# EAGLE design shiftreg-io (EAGLE 9.0.1)
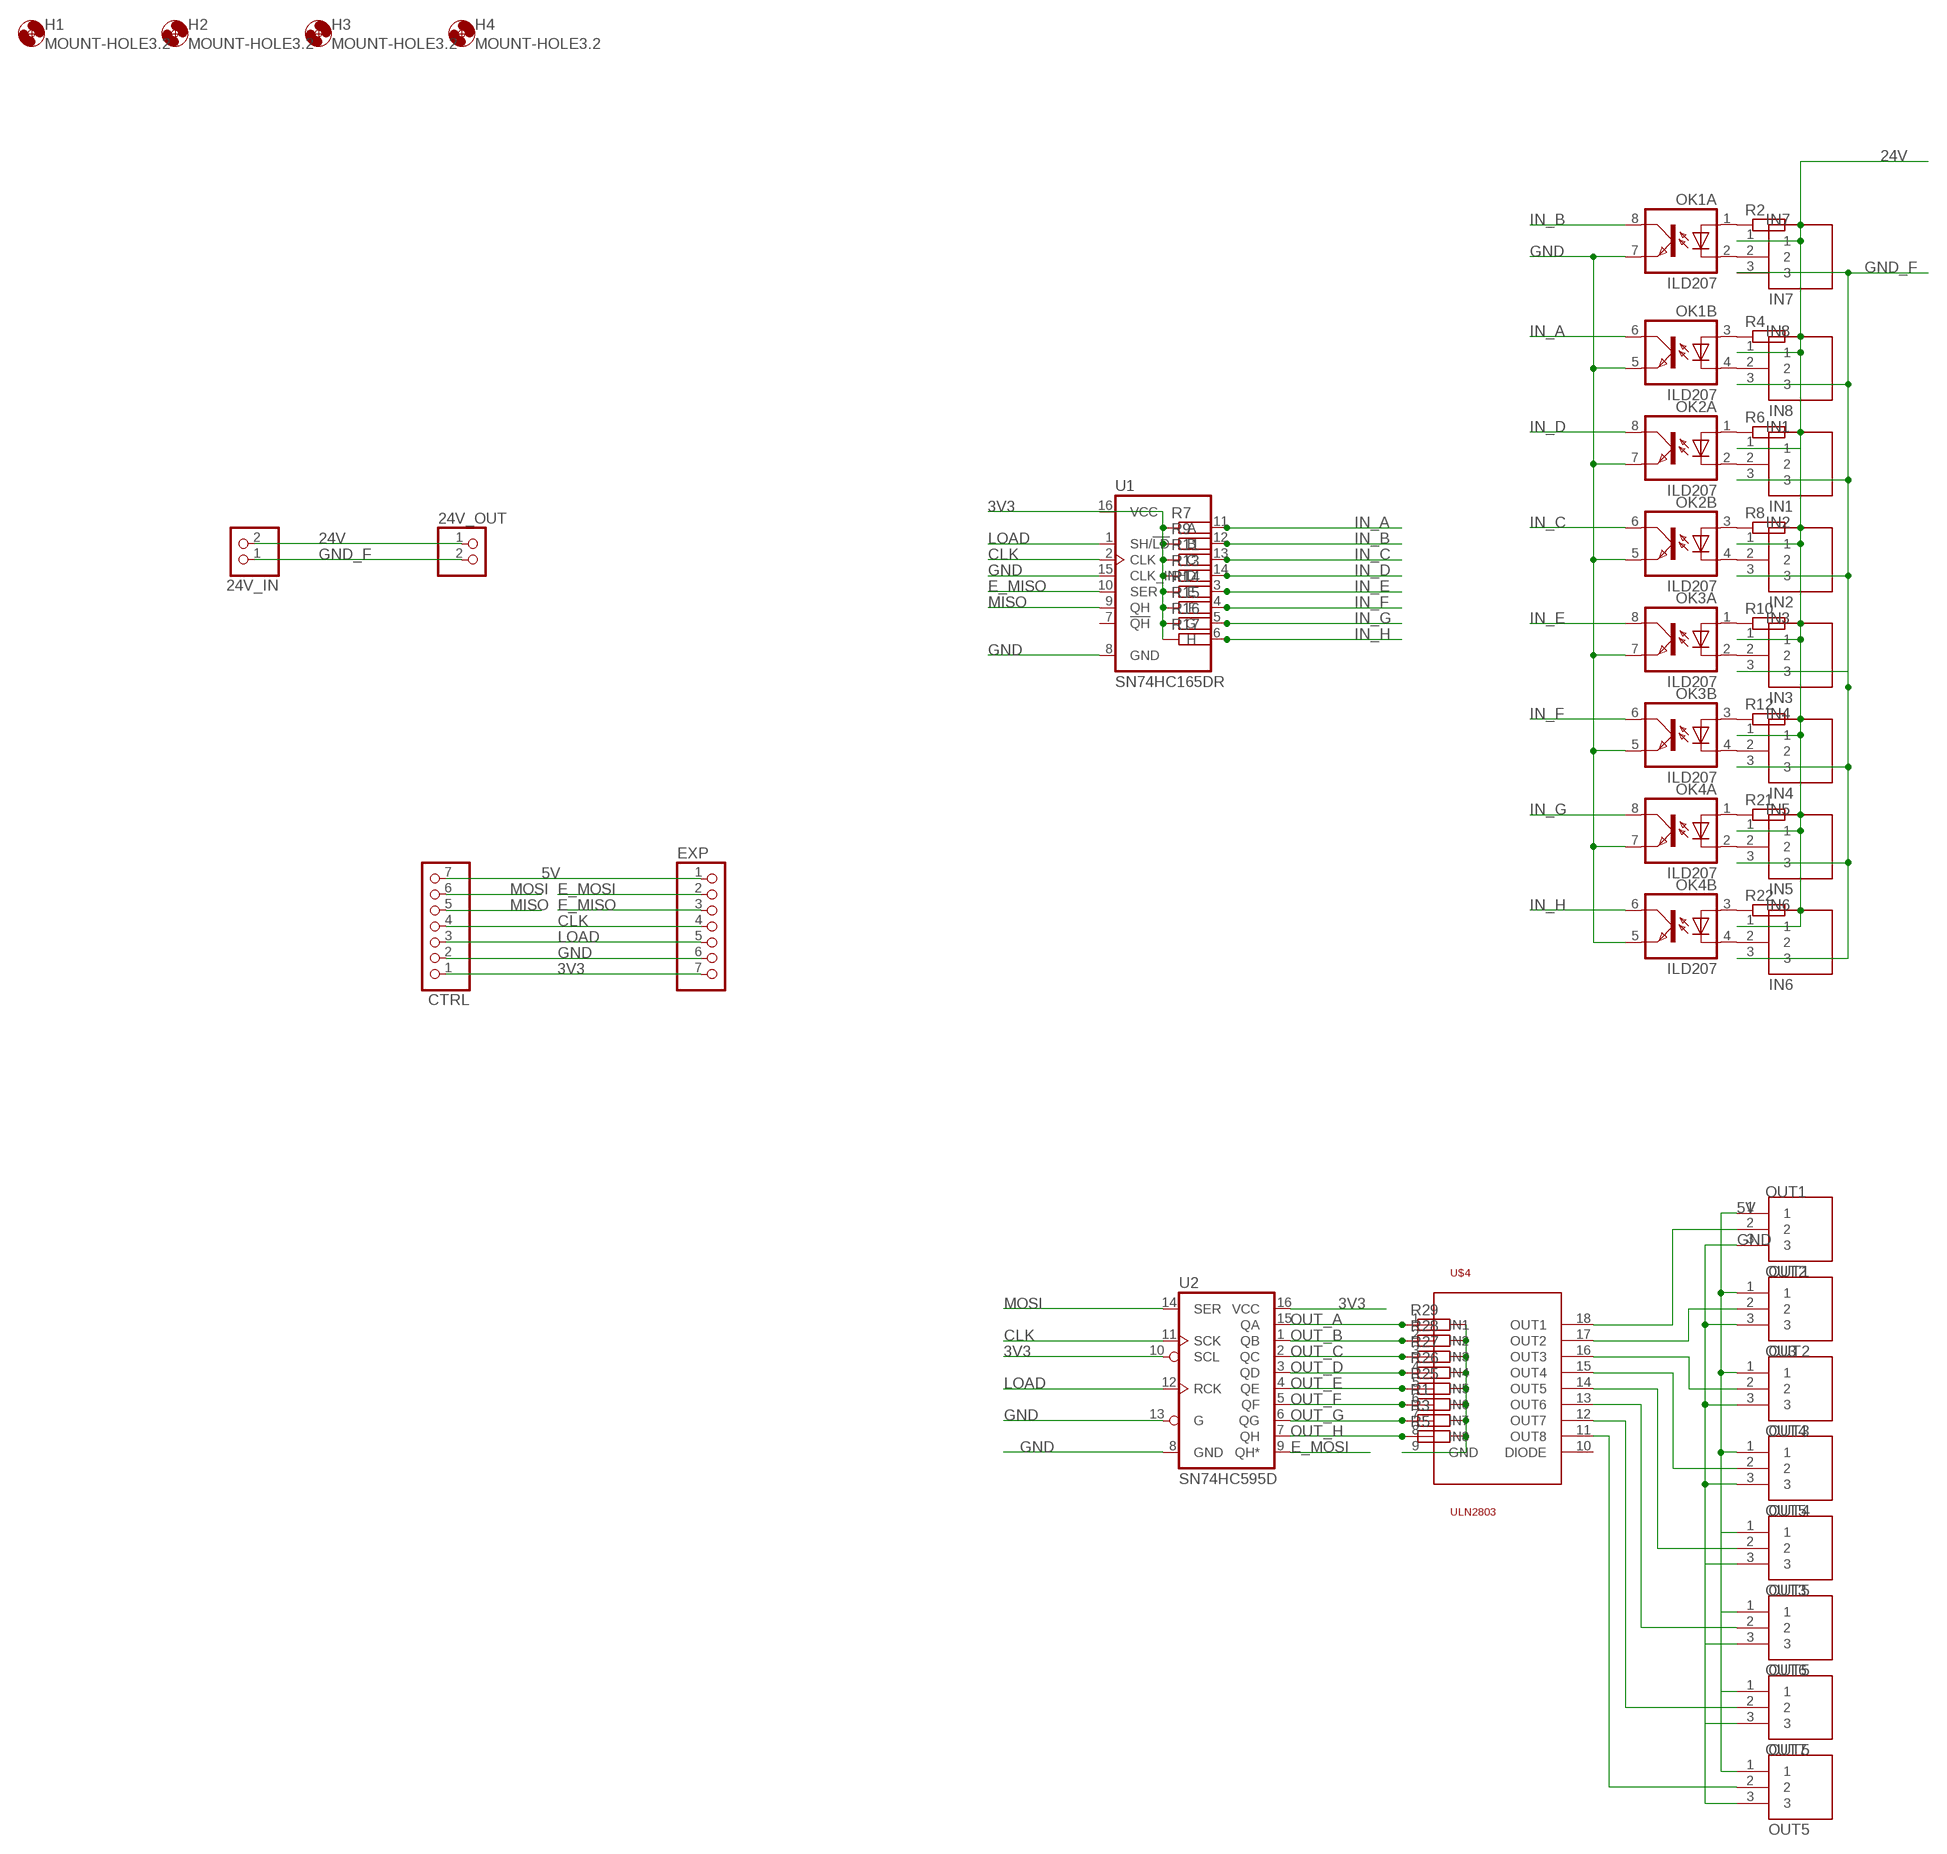
[diagram p0: schematic, sheet 1]

## Parts
24V_IN  PINHD-1X2  [1X02]
24V_OUT  PINHD-1X2  [1X02]
CTRL  PINHD-1X7  [1X07]
EXP  PINHD-1X7  [1X07]
H1  MOUNT-HOLE3.2  [3,2]
H2  MOUNT-HOLE3.2  [3,2]
H3  MOUNT-HOLE3.2  [3,2]
H4  MOUNT-HOLE3.2  [3,2]
IN1  IN1  284512-3  [TE_284512-3]
IN2  IN2  284512-3  [TE_284512-3]
IN3  IN3  284512-3  [TE_284512-3]
IN4  IN4  284512-3  [TE_284512-3]
IN5  IN5  284512-3  [TE_284512-3]
IN6  IN6  284512-3  [TE_284512-3]
IN7  IN7  284512-3  [TE_284512-3]
IN8  IN8  284512-3  [TE_284512-3]
OK1  ILD207  [SOIC08]
OK2  ILD207  [SOIC08]
OK3  ILD207  [SOIC08]
OK4  ILD207  [SOIC08]
OU3  OUT3  284512-3  [TE_284512-3]
OUT1  OUT1  284512-3  [TE_284512-3]
OUT2  OUT2  284512-3  [TE_284512-3]
OUT3  OUT5  284512-3  [TE_284512-3]
OUT4  OUT4  284512-3  [TE_284512-3]
OUT5  OUT5  284512-3  [TE_284512-3]
OUT6  OUT5  284512-3  [TE_284512-3]
OUT7  OUT5  284512-3  [TE_284512-3]
R1  R-EU_M0805  [M0805]
R2  R-EU_M0805  [M0805]
R3  R-EU_M0805  [M0805]
R4  R-EU_M0805  [M0805]
R5  R-EU_M0805  [M0805]
R6  R-EU_M0805  [M0805]
R7  R-EU_M0805  [M0805]
R8  R-EU_M0805  [M0805]
R9  R-EU_M0805  [M0805]
R10  R-EU_M0805  [M0805]
R11  R-EU_M0805  [M0805]
R12  R-EU_M0805  [M0805]
R13  R-EU_M0805  [M0805]
R14  R-EU_M0805  [M0805]
R15  R-EU_M0805  [M0805]
R16  R-EU_M0805  [M0805]
R17  R-EU_M0805  [M0805]
R21  R-EU_M0805  [M0805]
R22  R-EU_M0805  [M0805]
R25  R-EU_M0805  [M0805]
R26  R-EU_M0805  [M0805]
R27  R-EU_M0805  [M0805]
R28  R-EU_M0805  [M0805]
R29  R-EU_M0805  [M0805]
U1  SN74HC165DR  74HC165D  [SO16]
U2  SN74HC595D  74HC595D  [SO16]
U$4  ULN2803  [SO18L]

## Nets
3V3: CTRL.1 EXP.7 R7.1 R9.1 R11.1 R13.1 R14.1 R15.1 R16.1 R17.1 U1.16(VCC) U2.10(SCL) U2.16(VCC)
5V: CTRL.7 EXP.1 OU3.1 OUT1.1 OUT2.1 OUT3.1 OUT4.1 OUT5.1 OUT6.1 OUT7.1
24V: 24V_IN.2 24V_OUT.1 IN1.1 IN2.1 IN3.1 IN4.1 IN5.1 IN6.1 IN7.1 IN8.1 R2.2 R4.2 R6.2 R8.2 R10.2 R12.2 R21.2 R22.2
CLK: CTRL.4 EXP.4 U1.2(CLK) U2.11(SCK)
E_MISO: EXP.3 U1.10(SER)
E_MOSI: EXP.2 U2.9(QH*)
GND: CTRL.2 EXP.6 OK1.5(B:EMIT) OK1.7(A:EMIT) OK2.5(B:EMIT) OK2.7(A:EMIT) OK3.5(B:EMIT) OK3.7(A:EMIT) OK4.5(B:EMIT) OK4.7(A:EMIT) OU3.3 OUT1.3 OUT2.3 OUT3.3 OUT4.3 OUT5.3 OUT6.3 OUT7.3 R1.2 R3.2 R5.2 R25.2 R26.2 R27.2 R28.2 R29.2 U1.8(GND) U1.15(CLK_INH) U2.8(GND) U2.13(G) U$4.9(GND)
GND_F: 24V_IN.1 24V_OUT.2 IN1.3 IN2.3 IN3.3 IN4.3 IN5.3 IN6.3 IN7.3 IN8.3
IN_A: OK1.6(B:COL) R7.2 U1.11(A)
IN_B: OK1.8(A:COL) R9.2 U1.12(B)
IN_C: OK2.6(B:COL) R11.2 U1.13(C)
IN_D: OK2.8(A:COL) R13.2 U1.14(D)
IN_E: OK3.8(A:COL) R14.2 U1.3(E)
IN_F: OK3.6(B:COL) R15.2 U1.4(F)
IN_G: OK4.8(A:COL) R16.2 U1.5(G)
IN_H: OK4.6(B:COL) R17.2 U1.6(H)
LOAD: CTRL.3 EXP.5 U1.1(SH/!LD) U2.12(RCK)
MISO: CTRL.5 U1.9(QH)
MOSI: CTRL.6 U2.14(SER)
N$4: OUT3.2 U$4.13(OUT6)
N$5: OUT6.2 U$4.12(OUT7)
N$6: OUT7.2 U$4.11(OUT8)
N$17: IN7.2 OK1.2(A:C)
N$18: IN8.2 OK1.4(B:C)
N$19: IN1.2 OK2.2(A:C)
N$20: IN2.2 OK2.4(B:C)
N$21: IN3.2 OK3.2(A:C)
N$22: IN4.2 OK3.4(B:C)
N$23: IN5.2 OK4.2(A:C)
N$24: IN6.2 OK4.4(B:C)
N$27: OK1.1(A:A) R2.1
N$28: OK1.3(B:A) R4.1
N$29: OK2.1(A:A) R6.1
N$30: OK2.3(B:A) R8.1
N$31: OK3.1(A:A) R10.1
N$32: OK3.3(B:A) R12.1
N$33: OK4.1(A:A) R21.1
N$34: OK4.3(B:A) R22.1
N$37: OUT2.2 U$4.17(OUT2)
N$38: OU3.2 U$4.16(OUT3)
N$39: OUT4.2 U$4.15(OUT4)
N$40: OUT5.2 U$4.14(OUT5)
N$41: OUT1.2 U$4.18(OUT1)
OUT_A: R29.1 U2.15(QA) U$4.1(IN1)
OUT_B: R28.1 U2.1(QB) U$4.2(IN2)
OUT_C: R27.1 U2.2(QC) U$4.3(IN3)
OUT_D: R26.1 U2.3(QD) U$4.4(IN4)
OUT_E: R25.1 U2.4(QE) U$4.5(IN5)
OUT_F: R1.1 U2.5(QF) U$4.6(IN6)
OUT_G: R3.1 U2.6(QG) U$4.7(IN7)
OUT_H: R5.1 U2.7(QH) U$4.8(IN8)
Unconnected: U1.7(!QH) U$4.10(DIODE)

## Library data of the parts
24V_IN 24V_OUT = pinhead:PINHD-1X2: PIN HEADER
CTRL EXP = pinhead:PINHD-1X7: PIN HEADER
H1-H4 = holes:MOUNT-HOLE: MOUNTING HOLE with drill center marker
IN1-IN8 OU3 OUT1-OUT7 = 284512-3:284512-3: Check availability <https://pricing.snapeda.com/parts/284512-3/TE%20Connectivity/view-part?ref=eda>; AVAILABILITY: In Stock; CENTERLINE_PITCH: 3.5 mm[.138 in]; COMMENT: 284512-3; DESCRIPTION: Pluggable terminal block; socket; male; angled; 3.5mm;; EU_ROHS_COMPLIANCE: Compliant; MF: TE Connectivity; MP: 284512-3; NUMBER_OF_POSITIONS: 3; PACKAGE: None; PRICE: None; PURCHASE-URL: https://pricing.snapeda.com/search/part/284512-3/?ref=eda
OK1-OK4 = optocoupler:ILD2*: Siemens ILD205/206/207/211/213/217 DUAL PHOTOTRANSISTOR SMALL OUTLINE SURFACE MOUNT OPTOCOUPLER Source: 153385-da-01-en-Optocoupler_ILD205-T.pdf; MF: VISHAY/TELEFUNKEN; MPN: ILD207T; OC_FARNELL: 1469603; OC_NEWARK: 97C8648
R1-R17 R21 R22 R25-R29 = rcl:R-EU_: RESISTOR, European symbol; SPICEPREFIX: R
U1 = SparkFun-IC-Logic:74*165: 8-Bit Shift Register (Parallel to Serial) Datasheet <https://cdn.sparkfun.com/datasheets/BreakoutBoards/sn54hc165.pdf> SparkFun Products SparkFun Shift-In Breakout - SN74HC165 <https://www.sparkfun.com/products/11733> (BOB-11733); PROD_ID: IC-11325
U2 = SparkFun-IC-Logic:74*595: 8-Bit Shift Register (Serial to Parallel) Datasheet <http://cdn.sparkfun.com/datasheets/BreakoutBoards/MM74HC595.pdf> SparkFun Products SparkFun Shift Register Breakout - 74HC595 <https://www.sparkfun.com/products/10680> (BOB-10680); PROD_ID: IC-07875
U$4 = uln2803:ULN2803

## Board
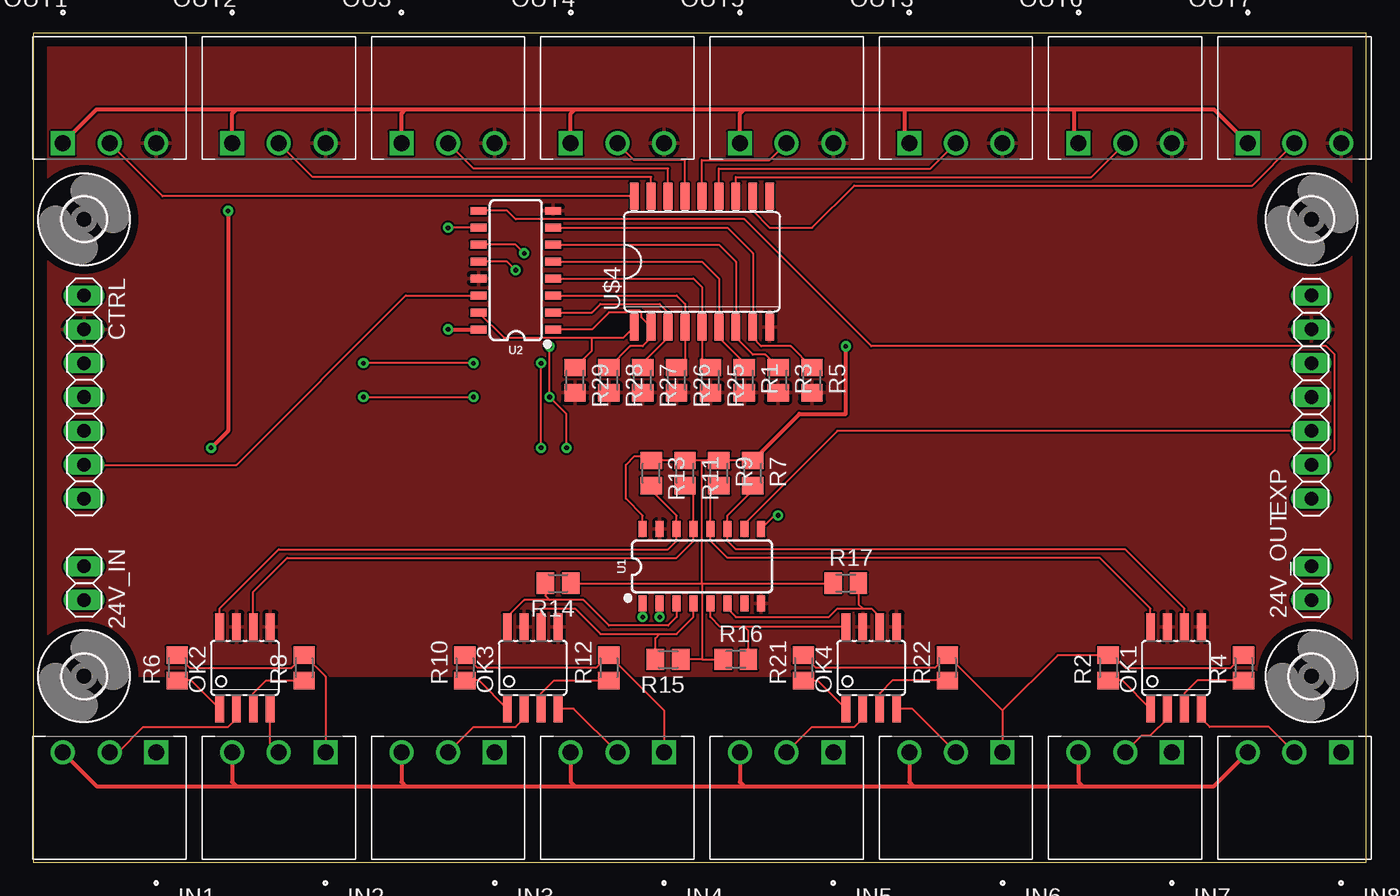
[diagram p1: board, top side]
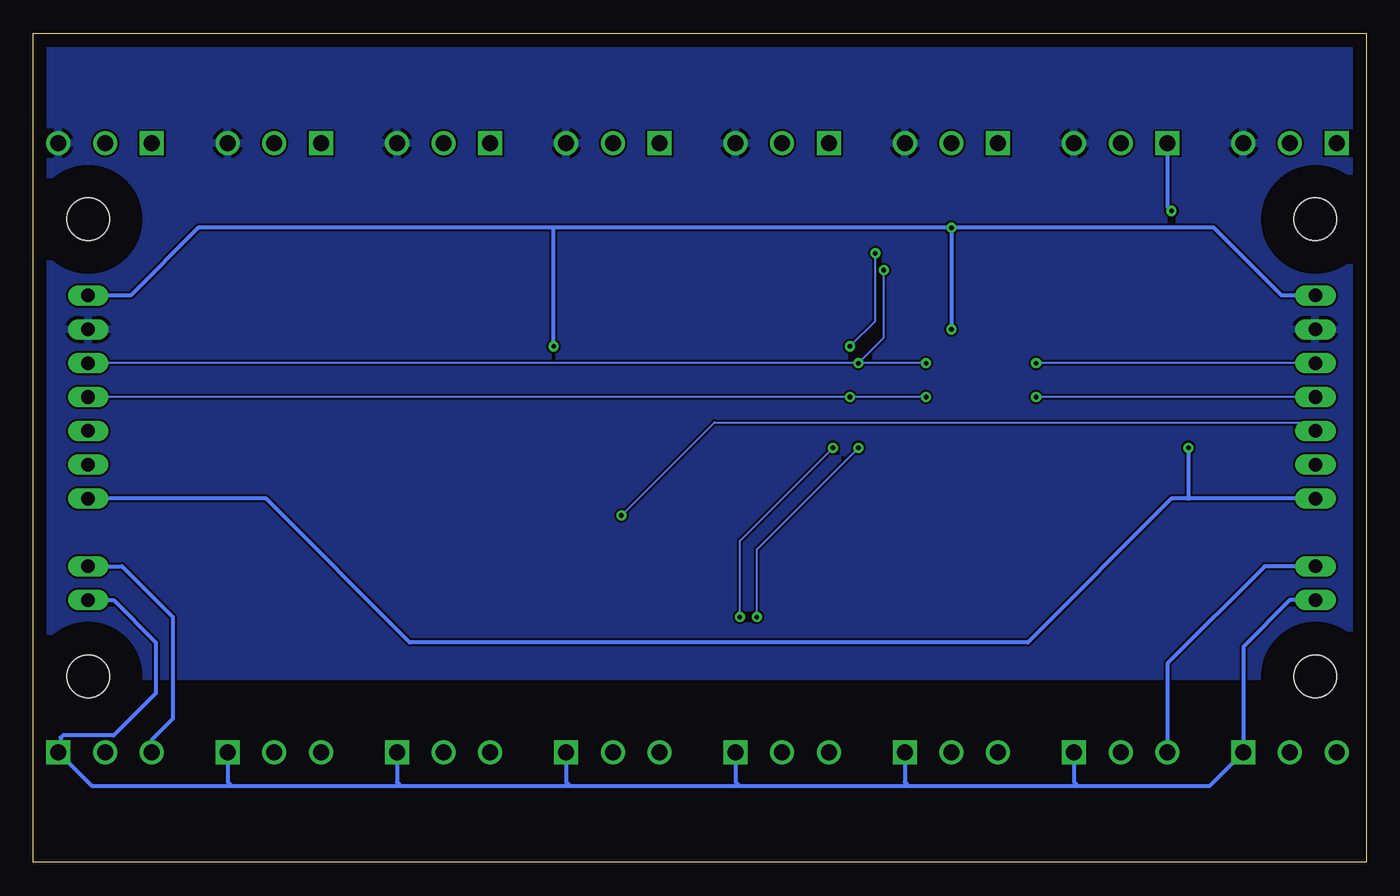
[diagram p2: board, bottom side, seen from below]

Size 100 x 62.22 mm. Coordinates in mm from the lower left corner, seen from the top.
Outline: 0,0 100,0 100,62.22 0,62.22 0,0
Copper layers (1*16): Top 0.035mm / dielectric 1.5mm / Bottom 0.035mm
Design rules "default": minimum track width 6mil, minimum drill 0.35mm, track to track 6mil, track to pad 6mil, pad to pad 6mil, via to via 6mil, smd to smd 6mil, copper to edge 40mil, drill to drill 6mil, minimum pad ring 10mil, minimum via ring 8mil, stop-mask expansion 4mil, vias tented up to drill 0mil, thermal gap 10mil

### Footprints (pad centres in the part's own frame; a part is rotated, then mirrored left to right if it is on the bottom)
1X02 = drill 1.016 long: 1 -1.27,0; 2 1.27,0
1X07 = drill 1.016 long: 1 -7.62,0; 2 -5.08,0; 3 -2.54,0; 4 0,0; 5 2.54,0; 6 5.08,0; 7 7.62,0
3,2 = hole 3.2: 0,0
TE_284512-3 = drill 1.2 square: 1 -3.5,0 | drill 1.2: 2 0,0; 3 3.5,0
SOIC08 = smd 0.66 x 2.032: 1 -1.905,-3.073; 2 -0.635,-3.073; 3 0.635,-3.073; 4 1.905,-3.073; 5 1.905,3.073; 6 0.635,3.073; 7 -0.635,3.073; 8 -1.905,3.073
M0805 = smd 1.3 x 1.6: 1 -0.95,0; 2 0.95,0
SO16 = smd 0.6 x 1.2: 1 -4.445,-2.8; 2 -3.175,-2.8; 3 -1.905,-2.8; 4 -0.635,-2.8; 5 0.635,-2.8; 6 1.905,-2.8; 7 3.175,-2.8; 8 4.445,-2.8; 9 4.445,2.8; 10 3.175,2.8; 11 1.905,2.8; 12 0.635,2.8; 13 -0.635,2.8; 14 -1.905,2.8; 15 -3.175,2.8; 16 -4.445,2.8
SO18L = smd 0.66 x 2.032: 1 -5.08,-4.902; 2 -3.81,-4.902; 3 -2.54,-4.902; 4 -1.27,-4.902; 5 0,-4.902; 6 1.27,-4.902; 7 2.54,-4.902; 8 3.81,-4.902; 9 5.08,-4.902; 10 5.08,4.902; 11 3.81,4.902; 12 2.54,4.902; 13 1.27,4.902; 14 0,4.902; 15 -1.27,4.902; 16 -2.54,4.902; 17 -3.81,4.902; 18 -5.08,4.902

### Placement (x,y rotation side)
24V_IN  3.81,20.96 270 top
24V_OUT  95.89,20.96 90 top
CTRL  3.81,34.93 270 top
EXP  95.89,34.93 90 top
H1  3.81,48.26 0 top
H2  95.89,48.26 0 top
H3  3.81,13.97 0 top
H4  95.89,13.97 0 top
IN1  5.71,8.25 180 top
IN2  18.42,8.25 180 top
IN3  31.11,8.25 180 top
IN4  43.81,8.25 180 top
IN5  56.52,8.25 180 top
IN6  69.22,8.25 180 top
IN7  81.92,8.25 180 top
IN8  94.62,8.25 180 top
OK1  85.73,14.6 0 top
OK2  15.88,14.6 0 top
OK3  37.47,14.6 0 top
OK4  62.87,14.6 0 top
OU3  31.11,53.98 0 top
OUT1  5.71,53.98 0 top
OUT2  18.42,53.98 0 top
OUT3  69.22,53.98 0 top
OUT4  43.81,53.98 0 top
OUT5  56.52,53.98 0 top
OUT6  81.92,53.98 0 top
OUT7  94.62,53.98 0 top
R1  53.34,36.2 270 top
R2  80.65,14.6 90 top
R3  55.88,36.2 270 top
R4  90.81,14.6 90 top
R5  58.42,36.2 270 top
R6  10.8,14.6 90 top
R7  53.98,29.21 270 top
R8  20.32,14.6 90 top
R9  51.44,29.21 270 top
R10  32.39,14.6 90 top
R11  48.9,29.21 270 top
R12  43.18,14.6 90 top
R13  46.36,29.21 270 top
R14  39.37,20.96 180 top
R15  47.62,15.24 180 top
R16  52.7,15.24 0 top
R17  60.96,20.96 0 top
R21  57.79,14.6 90 top
R22  68.58,14.6 90 top
R25  50.8,36.2 270 top
R26  48.26,36.2 270 top
R27  45.72,36.2 270 top
R28  43.18,36.2 270 top
R29  40.64,36.2 270 top
U1  50.17,22.23 0 top
U2  36.2,44.45 90 top
U$4  50.17,45.09 0 top

### Tracks (layer width: path | path; a pad name or v marks a point on that pad's centre or on a via)
3V3  (via drill 0.35)
  Top 0.152: R7.1 R9.1 50.17,30.16 | 50.17,30.16 R11.1 R13.1 46.03,30.48 45.08,30.48 44.45,29.85 44.45,27.3 45.72,26.04 U1.16 | R14.1 50.17,20.96 | 50.17,20.96 R17.1 | 50.17,20.96 50.17,30.16 | 50.17,20.96 50.17,15.24 | 50.17,15.24 R15.1 | 50.17,15.24 R16.1 | U2.10 v31.11,47.62
  Top 0.305: R7.1 57.47,33.66 60.96,33.66 v60.96,38.73 | v31.11,40.01 U2.16
  Bottom 0.305: CTRL.1 6.35,42.55 11.43,47.62 v31.11,47.62 | v31.11,47.62 60.96,47.62 | 60.96,47.62 87.63,47.62 92.71,42.55 EXP.7 | v60.96,38.73 60.96,47.62 | v31.11,47.62 v31.11,40.01
5V  (via drill 0.35)
  Top 0.305: OUT1.1 4.75,56.52 15.24,56.52 | OUT7.1 88.58,56.52 78.11,56.52 | 15.24,56.52 27.94,56.52 | 27.94,56.52 40.64,56.52 | 40.64,56.52 53.34,56.52 | 53.34,56.52 65.41,56.52 | 65.41,56.52 78.11,56.52 | OUT6.1 78.11,54.29 78.11,56.52 | OUT3.1 65.41,54.29 65.41,56.52 | OUT5.1 53.02,56.19 53.34,56.52 | OUT4.1 40.31,56.19 40.64,56.52 | OU3.1 27.61,56.19 27.94,56.52 | OUT2.1 14.92,56.19 15.24,56.52 | v14.61,48.9 14.61,32.38 v13.34,31.12
  Bottom 0.305: CTRL.7 13.34,27.3 | 13.34,27.3 14.61,27.3 25.4,16.51 71.76,16.51 82.55,27.3 EXP.1 | OUT2.1 14.92,49.2 v14.61,48.9 | v13.34,31.12 13.34,27.3
24V
  Top 0.152: R10.2 33.33,14.6 42.23,14.6 R12.2 47.31,11.42 IN4.1 | R21.2 58.73,14.6 67.63,14.6 R22.2 72.72,11.42 | 72.72,11.42 IN6.1 | R6.2 11.75,14.6 19.37,14.6 R8.2 21.92,13.96 IN2.1 | R4.2 89.86,14.6 81.92,14.6 80.97,15.55 R2.2 76.85,15.55 72.72,11.42
  Bottom 0.305: 97.95,8.09 95.58,5.71 85.09,5.71 | 97.95,8.09 IN8.1 | 21.59,5.71 11.75,5.71 IN1.1 9.21,16.18 5.71,19.69 24V_IN.2 | 21.59,5.71 34.29,5.71 | 34.29,5.71 46.99,5.71 | 46.99,5.71 59.69,5.71 | 59.69,5.71 72.39,5.71 | 72.39,5.71 85.09,5.71 | IN7.1 85.42,6.04 85.09,5.71 | IN6.1 72.72,6.04 72.39,5.71 | IN5.1 60.02,6.04 59.69,5.71 | IN4.1 47.31,6.04 46.99,5.71 | IN3.1 34.61,6.04 34.29,5.71 | IN2.1 21.92,6.04 21.59,5.71 | 24V_OUT.1 93.98,19.69 90.81,16.51 90.81,12.7 93.98,9.53 97.79,9.53 97.95,9.36 97.95,8.09
CLK  (via drill 0.35)
  Top 0.152: U1.2 v46.99,18.42 | v40,31.12 40,33.66 v38.73,34.93 v38.73,38.73 | v36.83,45.72 36.2,46.36 U2.11 | v24.76,34.93 v33.02,34.93
  Bottom 0.152: CTRL.4 v24.76,34.93 | v33.02,34.93 v38.73,34.93 EXP.4 | v46.99,18.42 46.99,24.13 v40,31.12 | v38.73,38.73 36.83,40.64 v36.83,45.72
E_MISO
  Top 0.152: EXP.3 60.33,32.38 53.34,25.4 U1.10
E_MOSI
  Top 0.152: EXP.2 96.52,29.85 97.64,30.96 97.64,38.1 97,38.73 62.87,38.73 53.34,48.26 36.2,48.26 35.56,48.9 U2.9
GND
  pour Bottom: -7.62,69.85 -6.98,13.97 111.76,13.97 111.13,69.85
  pour Top: -3.81,67.95 106.68,67.95 107.31,13.97 -3.17,13.97
GND_F
  Top 0.305: IN1.3 4.75,5.71 15.24,5.71 | IN8.3 88.58,5.71 78.74,5.71 | 15.24,5.71 27.94,5.71 | 27.94,5.71 40.64,5.71 | 40.64,5.71 53.34,5.71 | 53.34,5.71 66.04,5.71 | 66.04,5.71 78.74,5.71 | IN7.3 78.42,6.04 78.74,5.71 | IN6.3 65.72,6.04 66.04,5.71 | IN5.3 53.02,6.04 53.34,5.71 | IN4.3 40.31,6.04 40.64,5.71 | IN3.3 27.61,6.04 27.94,5.71 | IN2.3 14.92,6.04 15.24,5.71
  Bottom 0.305: 91.44,8.25 IN8.3 91.12,9.21 89.54,10.79 89.54,18.42 93.34,22.23 24V_OUT.2 | 24V_IN.1 7.62,22.23 14.92,14.93 IN2.3
IN_A
  Top 0.152: OK1.6 86.36,19.05 81.92,23.5 52.7,23.5 52.07,24.13 U1.11 52.07,26.04 53.98,27.94 R7.2
IN_B
  Top 0.152: OK1.8 83.82,19.05 80.01,22.86 52.07,22.86 50.8,24.13 U1.12 50.8,27.62 R9.2
IN_C
  Top 0.152: OK2.6 16.51,20.32 19.05,22.86 48.26,22.86 49.53,24.13 U1.13 49.53,27.62 R11.2
IN_D
  Top 0.152: OK2.8 13.97,19.05 18.42,23.5 47.62,23.5 48.26,24.13 U1.14 48.26,26.04 46.36,27.94 R13.2
IN_E
  Top 0.152: U1.3 48.26,18.42 47.62,17.78 43.18,17.78 41.28,19.69 38.73,19.69 | 38.73,19.69 36.83,19.69 35.56,18.42 OK3.8 | R14.2 38.42,20.01 38.73,19.69
IN_F
  Top 0.152: OK3.6 38.1,19.05 40.64,19.05 42.55,17.14 46.99,17.14 | 46.99,17.14 48.26,17.14 49.53,18.42 U1.4 | R15.2 46.67,16.83 46.99,17.14
IN_G
  Top 0.152: OK4.8 53.34,17.68 | 53.34,17.68 51.54,17.68 50.8,18.42 U1.5 | R16.2 53.66,17.36 53.34,17.68
IN_H
  Top 0.152: U1.6 52.07,19.05 52.7,18.42 59.69,18.42 60.33,19.05 62.23,19.05 | 62.23,19.05 62.87,19.05 63.5,18.42 OK4.6 | R17.2 61.92,19.37 62.23,19.05
LOAD  (via drill 0.35)
  Top 0.152: U1.1 v45.72,18.42 | v38.1,31.12 v38.1,37.47 | v36.2,44.45 35.56,45.09 U2.12 | v33.02,37.47 v24.76,37.47
  Bottom 0.152: v33.02,37.47 v38.1,37.47 | v38.1,37.47 EXP.5 | v45.72,18.42 45.72,23.5 v38.1,31.12 | v38.1,37.47 36.2,39.37 v36.2,44.45 | CTRL.3 v24.76,37.47
MISO  (via drill 0.35)
  Top 0.152: U1.9 55.62,26.04 v55.88,26.04
  Bottom 0.152: v55.88,26.04 48.9,33.02 4.45,33.02 CTRL.5
MOSI
  Top 0.152: CTRL.6 15.24,29.85 27.94,42.55 U2.14
N$4
  Top 0.152: U$4.13 51.44,52.07 67.31,52.07 OUT3.2
N$5
  Top 0.152: U$4.12 52.7,51.44 79.38,51.44 OUT6.2
N$6
  Top 0.152: U$4.11 53.98,48.9 55.25,47.62 58.42,47.62 61.59,50.8 91.44,50.8 OUT7.2
N$17
  Top 0.152: IN7.2 83.19,9.53 83.82,9.53 85.09,10.79 OK1.2
N$18
  Top 0.152: IN8.2 92.71,10.16 88.27,10.16 87.63,10.79 OK1.4
N$19
  Top 0.152: IN1.2 6.35,8.25 8.25,10.16 14.61,10.16 15.24,10.79 OK2.2
N$20
  Top 0.152: IN2.2 17.78,8.89 OK2.4
N$21
  Top 0.152: IN3.2 33.02,10.16 36.2,10.16 36.83,10.79 OK3.2
N$22
  Top 0.152: IN4.2 40.54,11.53 OK3.4
N$23
  Top 0.152: IN5.2 58.42,10.16 61.59,10.16 62.23,10.79 OK4.2
N$24
  Top 0.152: IN6.2 65.94,11.53 OK4.4
N$27
  Top 0.152: OK1.1 81.7,13.65 R2.1
N$28
  Top 0.152: R4.1 87.31,13.65 86.36,12.7 OK1.3
N$29
  Top 0.152: OK2.1 11.85,13.65 R6.1
N$30
  Top 0.152: OK2.3 16.51,12.7 17.46,13.65 R8.1
N$31
  Top 0.152: OK3.1 33.44,13.65 R10.1
N$32
  Top 0.152: OK3.3 38.1,12.7 39.06,13.65 R12.1
N$33
  Top 0.152: R21.1 58.84,13.65 OK4.1
N$34
  Top 0.152: R22.1 64.45,13.65 63.5,12.7 OK4.3
N$37
  Top 0.152: U$4.17 46.36,51.44 20.96,51.44 OUT2.2
N$38
  Top 0.152: U$4.16 47.62,52.07 33.02,52.07 OU3.2
N$39
  Top 0.152: U$4.15 48.9,52.7 45.08,52.7 OUT4.2
N$40
  Top 0.152: U$4.14 50.17,52.7 55.25,52.7 OUT5.2
N$41
  Top 0.152: U$4.18 9.7,49.99 OUT1.2
OUT_A
  Top 0.152: U2.15 35.3,39.37 41.91,39.37 | U$4.1 44.27,39.37 41.91,39.37 | R29.1 41.91,38.41 41.91,39.37
OUT_B
  Top 0.152: U2.1 41.91,40.01 43.18,41.27 44.51,41.27 44.66,41.43 45.51,41.43 45.64,41.29 45.64,40.89 U$4.2 46.36,39.37 45.72,38.73 44.77,38.73 R28.1
OUT_C
  Top 0.152: U2.2 41.91,41.27 42.55,41.91 46.99,41.91 47.62,41.27 U$4.3 47.62,39.37 45.72,37.47 R27.1
OUT_D
  Top 0.152: U2.3 48.26,42.55 48.9,41.91 U$4.4 48.9,37.78 R26.1
OUT_E
  Top 0.152: U2.4 49.53,43.81 50.17,43.18 U$4.5 50.17,37.78 R25.1
OUT_F
  Top 0.152: U2.5 50.17,45.09 51.44,43.81 U$4.6 51.44,39.37 53.34,37.47 R1.1
OUT_G
  Top 0.152: U2.6 51.44,46.36 52.7,45.09 U$4.7 52.7,39.37 53.98,38.1 54.92,38.1 R3.1
OUT_H
  Top 0.152: U2.7 52.07,47.62 53.98,45.72 U$4.8 53.98,39.37 54.61,38.73 56.83,38.73 R5.1